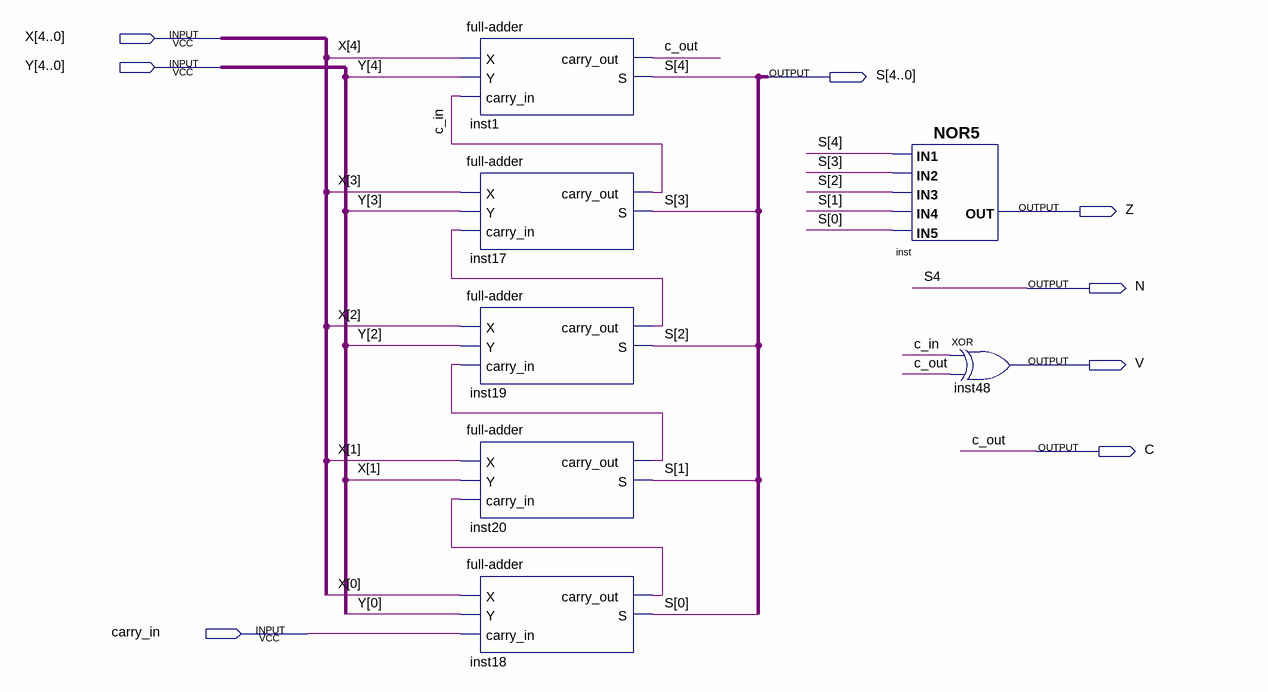
[diagram p0: schematic sheet]
// Quartus schematic Somador.bdf as structural Verilog: 7 symbols, 8 pins
module Somador (
  input  [4:0] X,
  input  [4:0] Y,
  input  carry_in,
  output [4:0] S,
  output Z,
  output N,
  output V,
  output C
);

  wire c_in, inst18_carry_out, inst19_carry_out, inst20_carry_out;

  \full-adder  inst1 (.X(X[4]), .Y(Y[4]), .carry_in(c_in), .carry_out(C), .S(N));
  \full-adder  inst17 (.X(X[3]), .Y(Y[3]), .carry_in(inst19_carry_out), .carry_out(c_in), .S(S[3]));
  \full-adder  inst19 (.X(X[2]), .Y(Y[2]), .carry_in(inst20_carry_out), .carry_out(inst19_carry_out), .S(S[2]));
  \full-adder  inst20 (.X(X[1]), .Y(X[1]), .carry_in(inst18_carry_out), .carry_out(inst20_carry_out), .S(S[1]));
  \full-adder  inst18 (.X(X[0]), .Y(Y[0]), .carry_in(carry_in), .carry_out(inst18_carry_out), .S(S[0]));
  nor inst (Z, N, S[3], S[2], S[1], S[0]);
  xor inst48 (V, c_in, C);

  assign S[4] = N;

  // Other names for the same wires on the sheet: c_out = C; S4 = N
endmodule
